# Altium schematic sheet Boost_and_AFR_Bar.SchDoc
size C
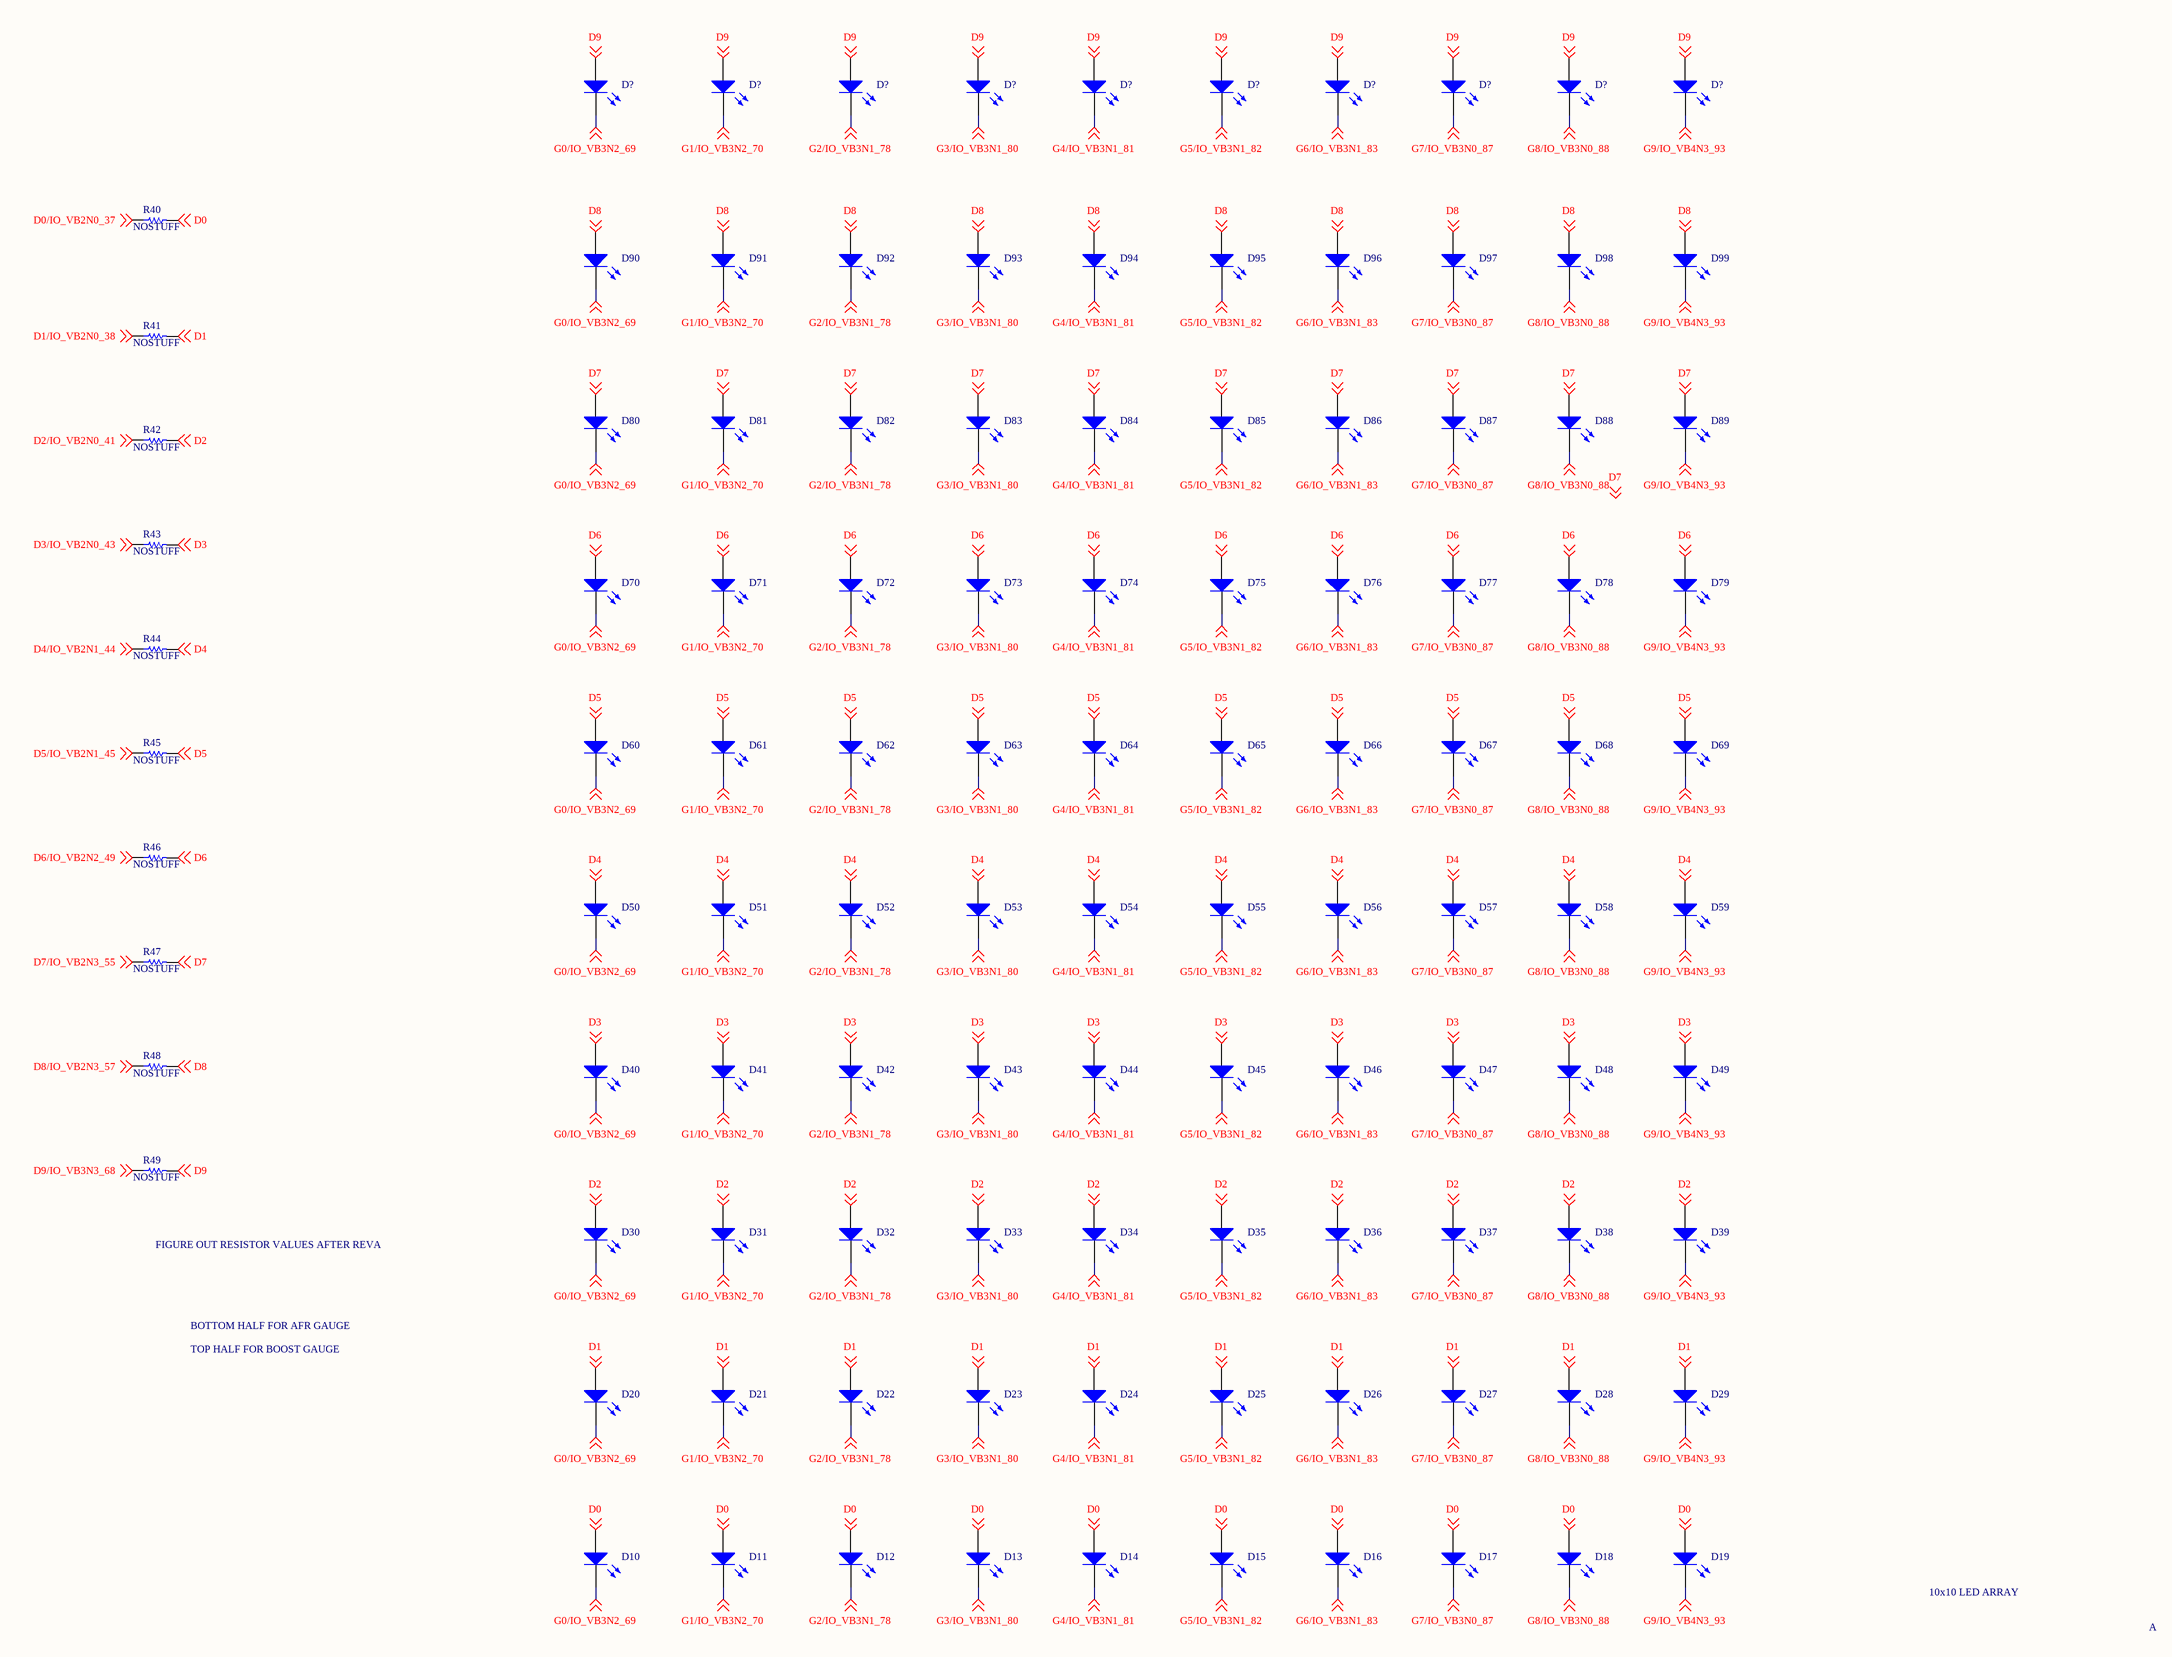
[diagram p0: Boost_and_AFR_Bar.SchDoc]

## Parts
(Parts that share a designator on the sheet are numbered #1, #2 ... from top to bottom, then left to right.)
D10  (no value)  [DIODE_0603]
D11  (no value)  [DIODE_0603]
D12  (no value)  [DIODE_0603]
D13  (no value)  [DIODE_0603]
D14  (no value)  [DIODE_0603]
D15  (no value)  [DIODE_0603]
D16  (no value)  [DIODE_0603]
D17  (no value)  [DIODE_0603]
D18  (no value)  [DIODE_0603]
D19  (no value)  [DIODE_0603]
D20  (no value)  [DIODE_0603]
D21  (no value)  [DIODE_0603]
D22  (no value)  [DIODE_0603]
D23  (no value)  [DIODE_0603]
D24  (no value)  [DIODE_0603]
D25  (no value)  [DIODE_0603]
D26  (no value)  [DIODE_0603]
D27  (no value)  [DIODE_0603]
D28  (no value)  [DIODE_0603]
D29  (no value)  [DIODE_0603]
D30  (no value)  [DIODE_0603]
D31  (no value)  [DIODE_0603]
D32  (no value)  [DIODE_0603]
D33  (no value)  [DIODE_0603]
D34  (no value)  [DIODE_0603]
D35  (no value)  [DIODE_0603]
D36  (no value)  [DIODE_0603]
D37  (no value)  [DIODE_0603]
D38  (no value)  [DIODE_0603]
D39  (no value)  [DIODE_0603]
D40  (no value)  [DIODE_0603]
D41  (no value)  [DIODE_0603]
D42  (no value)  [DIODE_0603]
D43  (no value)  [DIODE_0603]
D44  (no value)  [DIODE_0603]
D45  (no value)  [DIODE_0603]
D46  (no value)  [DIODE_0603]
D47  (no value)  [DIODE_0603]
D48  (no value)  [DIODE_0603]
D49  (no value)  [DIODE_0603]
D50  (no value)  [DIODE_0603]
D51  (no value)  [DIODE_0603]
D52  (no value)  [DIODE_0603]
D53  (no value)  [DIODE_0603]
D54  (no value)  [DIODE_0603]
D55  (no value)  [DIODE_0603]
D56  (no value)  [DIODE_0603]
D57  (no value)  [DIODE_0603]
D58  (no value)  [DIODE_0603]
D59  (no value)  [DIODE_0603]
D60  (no value)  [DIODE_0603]
D61  (no value)  [DIODE_0603]
D62  (no value)  [DIODE_0603]
D63  (no value)  [DIODE_0603]
D64  (no value)  [DIODE_0603]
D65  (no value)  [DIODE_0603]
D66  (no value)  [DIODE_0603]
D67  (no value)  [DIODE_0603]
D68  (no value)  [DIODE_0603]
D69  (no value)  [DIODE_0603]
D70  (no value)  [DIODE_0603]
D71  (no value)  [DIODE_0603]
D72  (no value)  [DIODE_0603]
D73  (no value)  [DIODE_0603]
D74  (no value)  [DIODE_0603]
D75  (no value)  [DIODE_0603]
D76  (no value)  [DIODE_0603]
D77  (no value)  [DIODE_0603]
D78  (no value)  [DIODE_0603]
D79  (no value)  [DIODE_0603]
D80  (no value)  [DIODE_0603]
D81  (no value)  [DIODE_0603]
D82  (no value)  [DIODE_0603]
D83  (no value)  [DIODE_0603]
D84  (no value)  [DIODE_0603]
D85  (no value)  [DIODE_0603]
D86  (no value)  [DIODE_0603]
D87  (no value)  [DIODE_0603]
D88  (no value)  [DIODE_0603]
D89  (no value)  [DIODE_0603]
D90  (no value)  [DIODE_0603]
D91  (no value)  [DIODE_0603]
D92  (no value)  [DIODE_0603]
D93  (no value)  [DIODE_0603]
D94  (no value)  [DIODE_0603]
D95  (no value)  [DIODE_0603]
D96  (no value)  [DIODE_0603]
D97  (no value)  [DIODE_0603]
D98  (no value)  [DIODE_0603]
D99  (no value)  [DIODE_0603]
D?#1  (no value)  [DIODE_0603]
D?#2  (no value)  [DIODE_0603]
D?#3  (no value)  [DIODE_0603]
D?#4  (no value)  [DIODE_0603]
D?#5  (no value)  [DIODE_0603]
D?#6  (no value)  [DIODE_0603]
D?#7  (no value)  [DIODE_0603]
D?#8  (no value)  [DIODE_0603]
D?#9  (no value)  [DIODE_0603]
D?#10  (no value)  [DIODE_0603]
R40  value NOSTUFF  [RES_0603]  (hidden comment: Figure out ohmage after RevA)
R41  value NOSTUFF  [RES_0603]  (hidden comment: Figure out ohmage after RevA)
R42  value NOSTUFF  [RES_0603]  (hidden comment: Figure out ohmage after RevA)
R43  value NOSTUFF  [RES_0603]  (hidden comment: Figure out ohmage after RevA)
R44  value NOSTUFF  [RES_0603]  (hidden comment: Figure out ohmage after RevA)
R45  value NOSTUFF  [RES_0603]  (hidden comment: Figure out ohmage after RevA)
R46  value NOSTUFF  [RES_0603]  (hidden comment: Figure out ohmage after RevA)
R47  value NOSTUFF  [RES_0603]  (hidden comment: Figure out ohmage after RevA)
R48  value NOSTUFF  [RES_0603]  (hidden comment: Figure out ohmage after RevA)
R49  value NOSTUFF  [RES_0603]  (hidden comment: Figure out ohmage after RevA)

## Nets
D0: D10.1(A) D11.1(A) D12.1(A) D13.1(A) D14.1(A) D15.1(A) D16.1(A) D17.1(A) D18.1(A) D19.1(A) R40.2 ; off-sheet D0
D0/IO_VB2N0_37: R40.1 ; off-sheet D0/IO_VB2N0_37
D1: D20.1(A) D21.1(A) D22.1(A) D23.1(A) D24.1(A) D25.1(A) D26.1(A) D27.1(A) D28.1(A) D29.1(A) R41.2 ; off-sheet D1
D1/IO_VB2N0_38: R41.1 ; off-sheet D1/IO_VB2N0_38
D2: D30.1(A) D31.1(A) D32.1(A) D33.1(A) D34.1(A) D35.1(A) D36.1(A) D37.1(A) D38.1(A) D39.1(A) R42.2 ; off-sheet D2
D2/IO_VB2N0_41: R42.1 ; off-sheet D2/IO_VB2N0_41
D3: D40.1(A) D41.1(A) D42.1(A) D43.1(A) D44.1(A) D45.1(A) D46.1(A) D47.1(A) D48.1(A) D49.1(A) R43.2 ; off-sheet D3
D3/IO_VB2N0_43: R43.1 ; off-sheet D3/IO_VB2N0_43
D4: D50.1(A) D51.1(A) D52.1(A) D53.1(A) D54.1(A) D55.1(A) D56.1(A) D57.1(A) D58.1(A) D59.1(A) R44.2 ; off-sheet D4
D4/IO_VB2N1_44: R44.1 ; off-sheet D4/IO_VB2N1_44
D5: D60.1(A) D61.1(A) D62.1(A) D63.1(A) D64.1(A) D65.1(A) D66.1(A) D67.1(A) D68.1(A) D69.1(A) R45.2 ; off-sheet D5
D5/IO_VB2N1_45: R45.1 ; off-sheet D5/IO_VB2N1_45
D6: D70.1(A) D71.1(A) D72.1(A) D73.1(A) D74.1(A) D75.1(A) D76.1(A) D77.1(A) D78.1(A) D79.1(A) R46.2 ; off-sheet D6
D6/IO_VB2N2_49: R46.1 ; off-sheet D6/IO_VB2N2_49
D7: D80.1(A) D81.1(A) D82.1(A) D83.1(A) D84.1(A) D85.1(A) D86.1(A) D87.1(A) D88.1(A) D89.1(A) R47.2 ; off-sheet D7
D7/IO_VB2N3_55: R47.1 ; off-sheet D7/IO_VB2N3_55
D8: D90.1(A) D91.1(A) D92.1(A) D93.1(A) D94.1(A) D95.1(A) D96.1(A) D97.1(A) D98.1(A) D99.1(A) R48.2 ; off-sheet D8
D8/IO_VB2N3_57: R48.1 ; off-sheet D8/IO_VB2N3_57
D9: D?#1.1(A) D?#2.1(A) D?#3.1(A) D?#4.1(A) D?#5.1(A) D?#6.1(A) D?#7.1(A) D?#8.1(A) D?#9.1(A) D?#10.1(A) R49.2 ; off-sheet D9
D9/IO_VB3N3_68: R49.1 ; off-sheet D9/IO_VB3N3_68
G0/IO_VB3N2_69: D10.2(K) D20.2(K) D30.2(K) D40.2(K) D50.2(K) D60.2(K) D70.2(K) D80.2(K) D90.2(K) D?#1.2(K) ; off-sheet G0/IO_VB3N2_69
G1/IO_VB3N2_70: D11.2(K) D21.2(K) D31.2(K) D41.2(K) D51.2(K) D61.2(K) D71.2(K) D81.2(K) D91.2(K) D?#2.2(K) ; off-sheet G1/IO_VB3N2_70
G2/IO_VB3N1_78: D12.2(K) D22.2(K) D32.2(K) D42.2(K) D52.2(K) D62.2(K) D72.2(K) D82.2(K) D92.2(K) D?#3.2(K) ; off-sheet G2/IO_VB3N1_78
G3/IO_VB3N1_80: D13.2(K) D23.2(K) D33.2(K) D43.2(K) D53.2(K) D63.2(K) D73.2(K) D83.2(K) D93.2(K) D?#4.2(K) ; off-sheet G3/IO_VB3N1_80
G4/IO_VB3N1_81: D14.2(K) D24.2(K) D34.2(K) D44.2(K) D54.2(K) D64.2(K) D74.2(K) D84.2(K) D94.2(K) D?#5.2(K) ; off-sheet G4/IO_VB3N1_81
G5/IO_VB3N1_82: D15.2(K) D25.2(K) D35.2(K) D45.2(K) D55.2(K) D65.2(K) D75.2(K) D85.2(K) D95.2(K) D?#6.2(K) ; off-sheet G5/IO_VB3N1_82
G6/IO_VB3N1_83: D16.2(K) D26.2(K) D36.2(K) D46.2(K) D56.2(K) D66.2(K) D76.2(K) D86.2(K) D96.2(K) D?#7.2(K) ; off-sheet G6/IO_VB3N1_83
G7/IO_VB3N0_87: D17.2(K) D27.2(K) D37.2(K) D47.2(K) D57.2(K) D67.2(K) D77.2(K) D87.2(K) D97.2(K) D?#8.2(K) ; off-sheet G7/IO_VB3N0_87
G8/IO_VB3N0_88: D18.2(K) D28.2(K) D38.2(K) D48.2(K) D58.2(K) D68.2(K) D78.2(K) D88.2(K) D98.2(K) D?#9.2(K) ; off-sheet G8/IO_VB3N0_88
G9/IO_VB4N3_93: D19.2(K) D29.2(K) D39.2(K) D49.2(K) D59.2(K) D69.2(K) D79.2(K) D89.2(K) D99.2(K) D?#10.2(K) ; off-sheet G9/IO_VB4N3_93

## Notes on the sheet
- FIGURE OUT RESISTOR VALUES AFTER REVA
- BOTTOM HALF FOR AFR GAUGE
- TOP HALF FOR BOOST GAUGE
- 10x10 LED ARRAY
- A
- Labels drawn without touching a wire or pin: D7

## Library data of the parts
D10-D99 D?#1-D?#10 = LED0: Typical INFRARED GaAs LED; Published: 8-Jun-2000; LatestRevisionDate: 08-Jul-2005; LatestRevisionNote: Mech Layer 1 removed.; PackageReference: LED-0; Publisher: Altium Limited; PackageDescription: LED; 2 Leads
R40-R49 = Res1: Resistor; Published: 8-Jun-2000; LatestRevisionDate: 17-Jul-2002; LatestRevisionNote: Re-released for DXP Platform.; PackageReference: AXIAL-0.3; Publisher: Altium Limited; PackageDescription: Axial Device, Thru-Hole; 2 Leads; 0.3 in Pin Spacing